# EAGLE design MAX-6566-Adapter v2.1 (EAGLE 7.7.0)
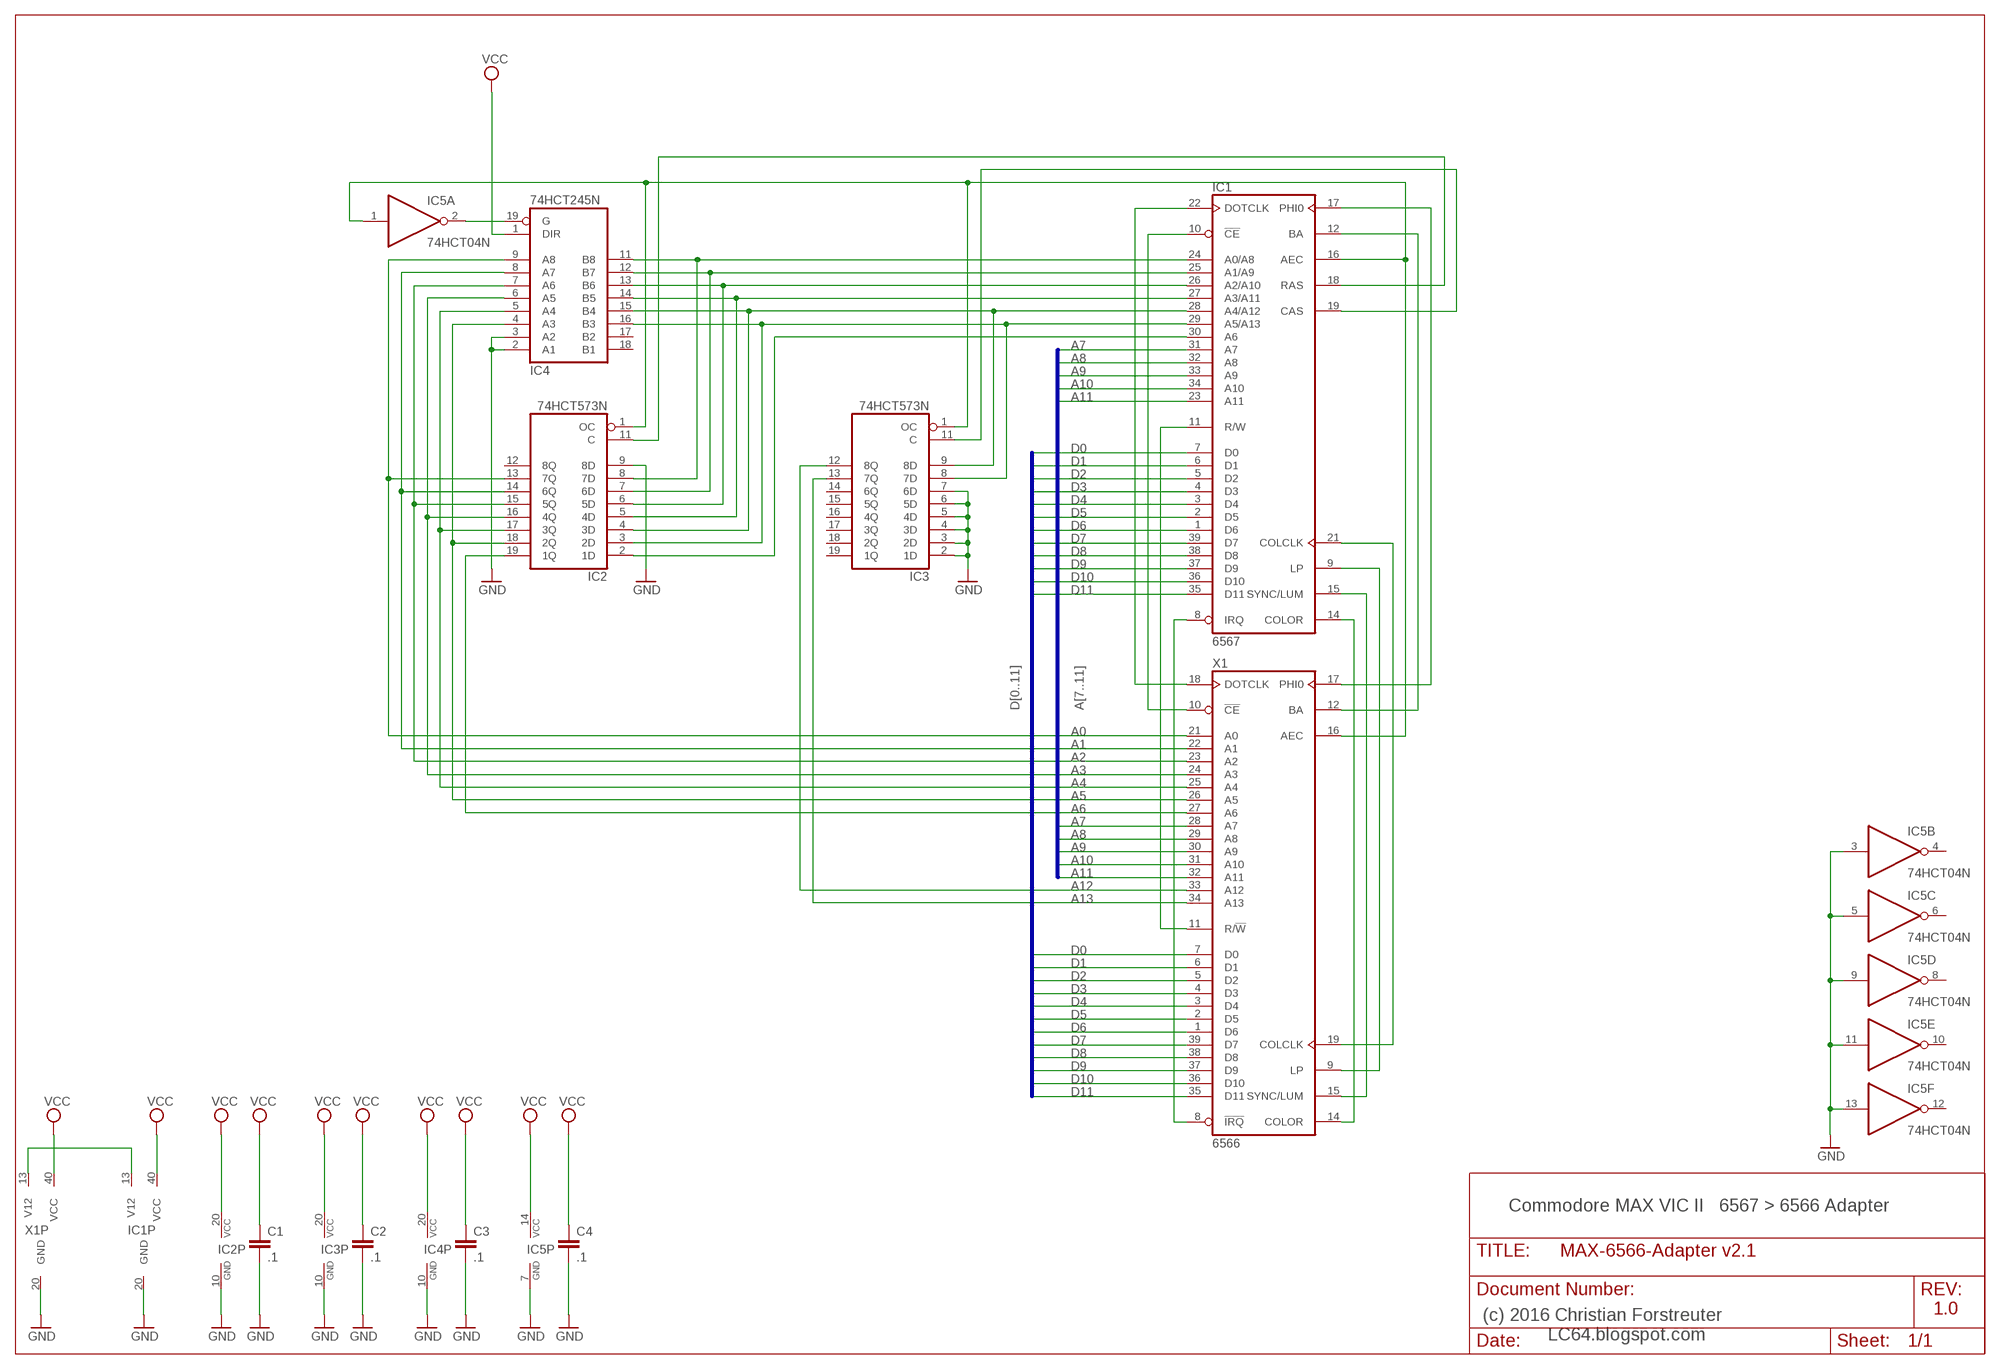
[diagram p0: schematic, sheet 1]

## Parts
C1  .1  C-EU025-024X044  [C025-024X044]
C2  .1  C-EU025-024X044  [C025-024X044]
C3  .1  C-EU025-024X044  [C025-024X044]
C4  .1  C-EU025-024X044  [C025-024X044]
IC1  6567  6569-RP  [DIL40-ROUNDPAD]
IC2  74HCT573N  74XX-EU_74HCT573N  [74XX-EU_DIL20]
IC3  74HCT573N  74XX-EU_74HCT573N  [74XX-EU_DIL20]
IC4  74HCT245N  74XX-EU_74HCT245N  [74XX-EU_DIL20]
IC5  74HCT04N  74XX-EU_74HCT04N  [74XX-EU_DIL14]
X1  6566  6566-RP  [DIL40-ROUNDPAD]

## Nets
A0: IC2.13(7Q) IC4.9(A8) X1.21(A0)
A1: IC2.14(6Q) IC4.8(A7) X1.22(A1)
A2: IC2.15(5Q) IC4.7(A6) X1.23(A2)
A3: IC2.16(4Q) IC4.6(A5) X1.24(A3)
A4: IC2.17(3Q) IC4.5(A4) X1.25(A4)
A5: IC2.18(2Q) IC4.4(A3) X1.26(A5)
A6: IC2.19(1Q) X1.27(A6)
A7: IC1.31(A7) X1.28(A7)
A8: IC1.32(A8) X1.29(A8)
A9: IC1.33(A9) X1.30(A9)
A10: IC1.34(A10) X1.31(A10)
A11: IC1.23(A11) X1.32(A11)
A12: IC3.12(8Q) X1.33(A12)
A13: IC3.13(7Q) X1.34(A13)
AEC: IC1.16(AEC) IC2.1(OC) IC3.1(OC) IC5.1(A:I) X1.16(AEC)
D0: IC1.7(D0) X1.7(D0)
D1: IC1.6(D1) X1.6(D1)
D2: IC1.5(D2) X1.5(D2)
D3: IC1.4(D3) X1.4(D3)
D4: IC1.3(D4) X1.3(D4)
D5: IC1.2(D5) X1.2(D5)
D6: IC1.1(D6) X1.1(D6)
D7: IC1.39(D7) X1.39(D7)
D8: IC1.38(D8) X1.38(D8)
D9: IC1.37(D9) X1.37(D9)
D10: IC1.36(D10) X1.36(D10)
D11: IC1.35(D11) X1.35(D11)
GND: C1.2 C2.2 C3.2 C4.2 IC1.20(GND) IC2.9(8D) IC2.10(GND) IC3.2(1D) IC3.3(2D) IC3.4(3D) IC3.5(4D) IC3.6(5D) IC3.7(6D) IC3.10(GND) IC4.2(A1) IC4.3(A2) IC4.10(GND) IC5.3(B:I) IC5.5(C:I) IC5.7(P:GND) IC5.9(D:I) IC5.11(E:I) IC5.13(F:I) X1.20(GND)
N$1: IC1.9(LP) X1.9(LP)
N$3: IC1.12(BA) X1.12(BA)
N$4: IC1.17(PHI0) X1.17(PHI0)
N$5: IC1.15(SYNC/LUM) X1.15(SYNC/LUM)
N$6: IC1.14(COLOR) X1.14(COLOR)
N$7: IC1.22(DOTCLK) X1.18(DOTCLK)
N$8: IC1.21(COLCLK) X1.19(COLCLK)
N$9: IC1.11(R/W) X1.11(R/!W)
N$10: IC1.8(IRQ) X1.8(!IRQ)
N$11: IC1.10(!CE) X1.10(!CE)
N$21: IC4.19(G) IC5.2(A:O)
N$22: IC1.24(A0/A8) IC2.8(7D) IC4.11(B8)
N$23: IC1.18(RAS) IC2.11(C)
N$24: IC1.19(CAS) IC3.11(C)
N$25: IC1.13(V12) X1.13(V12)
N$26: IC1.26(A2/A10) IC2.6(5D) IC4.13(B6)
N$27: IC1.27(A3/A11) IC2.5(4D) IC4.14(B5)
N$28: IC1.28(A4/A12) IC2.4(3D) IC3.9(8D) IC4.15(B4)
N$29: IC1.29(A5/A13) IC2.3(2D) IC3.8(7D) IC4.16(B3)
N$30: IC1.30(A6) IC2.2(1D)
N$35: IC1.25(A1/A9) IC2.7(6D) IC4.12(B7)
VCC: C1.1 C2.1 C3.1 C4.1 IC1.40(VCC) IC2.20(VCC) IC3.20(VCC) IC4.1(DIR) IC4.20(VCC) IC5.14(P:VCC) X1.40(VCC)
Unconnected: IC2.12(8Q) IC3.14(6Q) IC3.15(5Q) IC3.16(4Q) IC3.17(3Q) IC3.18(2Q) IC3.19(1Q) IC4.17(B2) IC4.18(B1) IC5.4(B:O) IC5.6(C:O) IC5.8(D:O) IC5.10(E:O) IC5.12(F:O)

## Buses
D[0..11]
A[7..11]

## Notes on the sheet
- Commodore MAX VIC II   6567 > 6566 Adapter
- 1.0
- (c) 2016 Christian Forstreuter
               LC64.blogspot.com

## Library data of the parts
C1-C4 = rcl:C-EU: CAPACITOR, European symbol
IC1 = commodore:6569: Video IC, PAL-version, used in the Commodore 64 and VIC-10. 6567 NTSC version is pin compatible.
IC2 IC3 = MAX-6566-Adapter:74XX-EU_74*573: 8-bit D latch BUS DRIVER
IC4 = MAX-6566-Adapter:74XX-EU_74*245: Octal BUS TRANSCEIVER, 3-state
IC5 = MAX-6566-Adapter:74XX-EU_74*04: Hex INVERTER
X1 = commodore:6566: Video IC, PAL-version, used in the Commodore 64 and VIC-10. 6567 NTSC version is pin compatible.

## Board
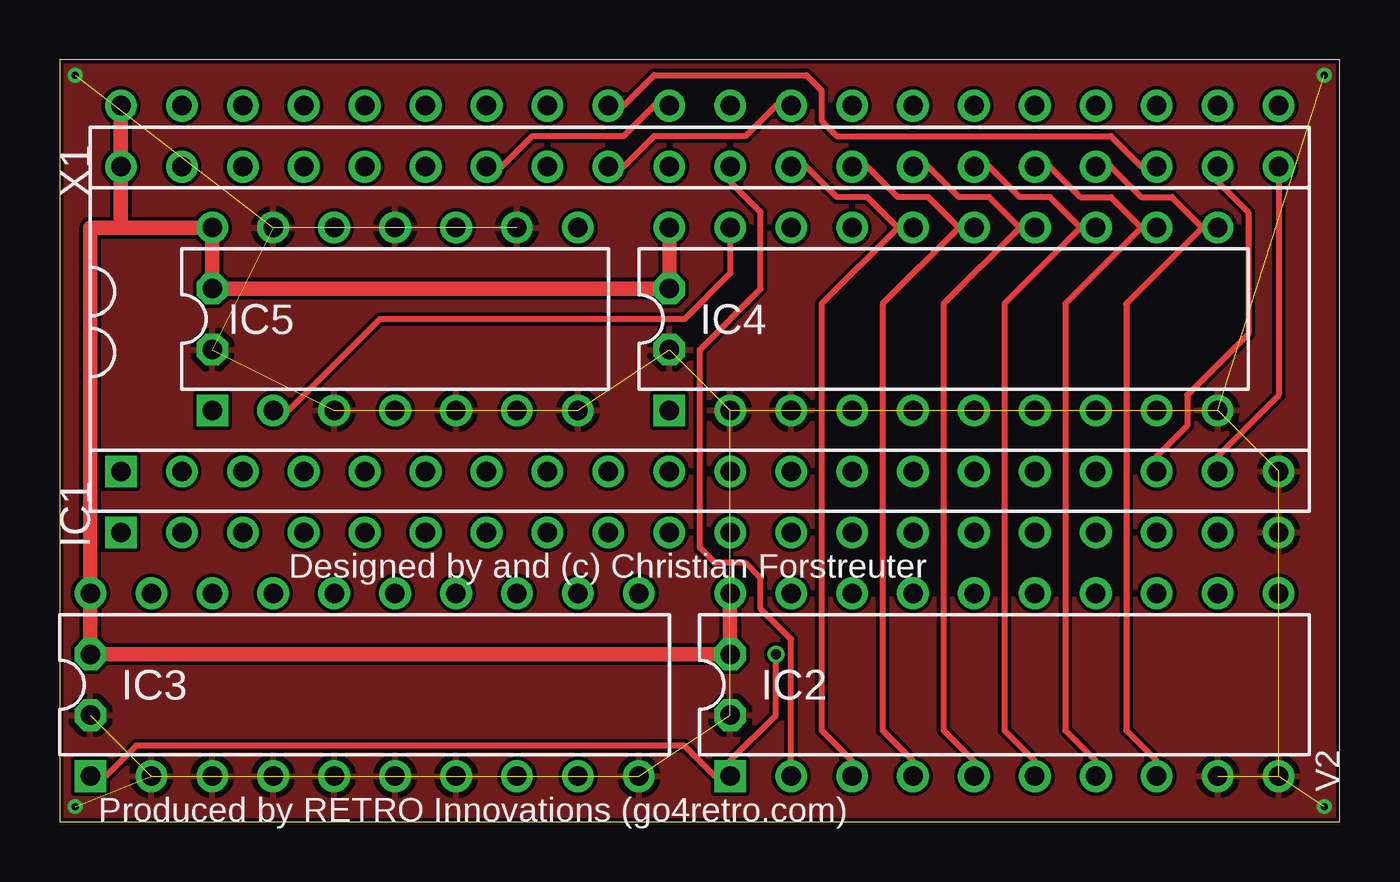
[diagram p1: board, top side]
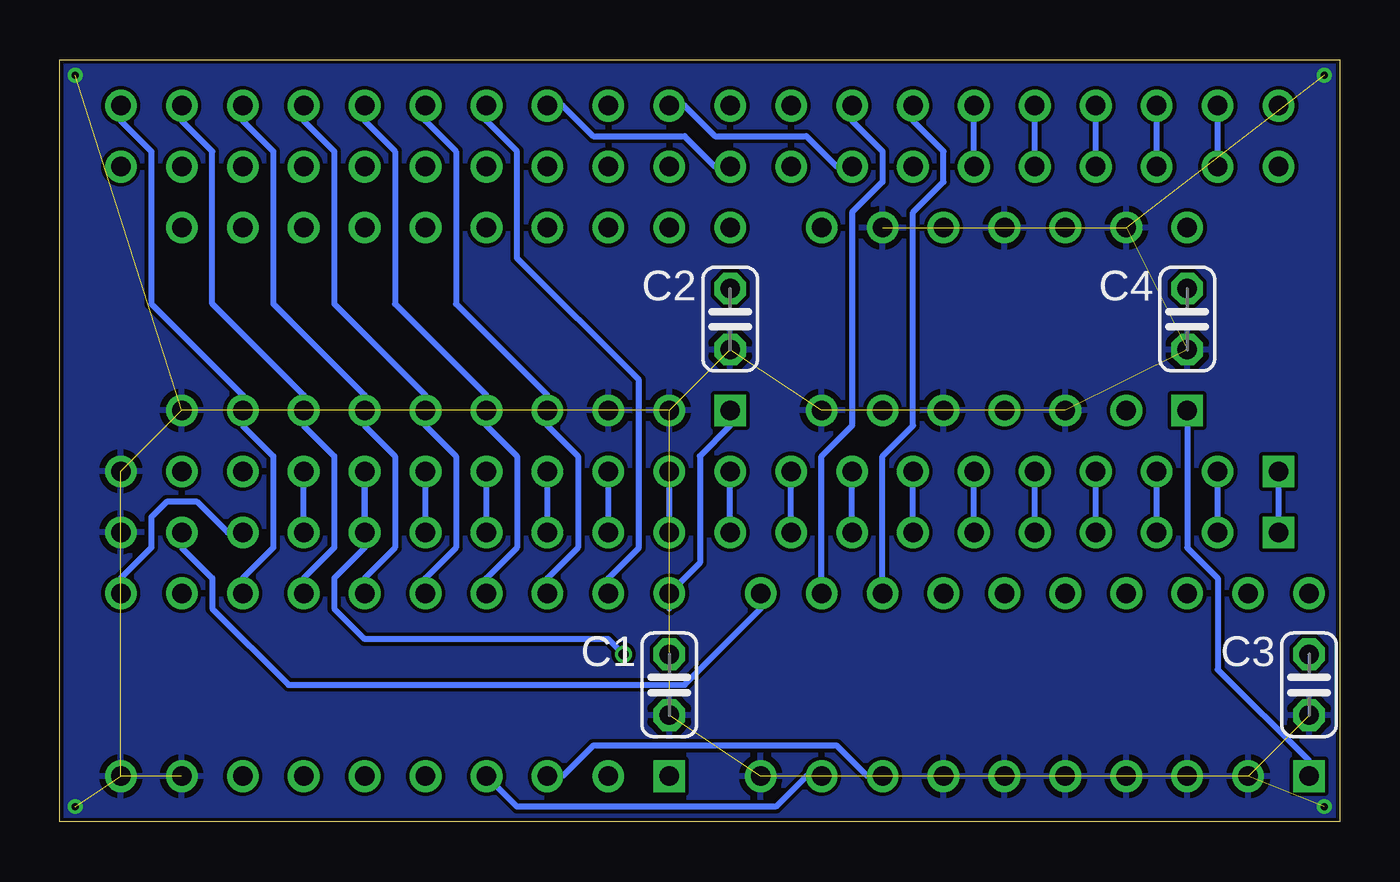
[diagram p2: board, bottom side, seen from below]

Size 53.34 x 31.75 mm. Coordinates in mm from the lower left corner, seen from the top.
Outline: 0,0 53.34,0 53.34,31.75 0,31.75 0,0
Copper layers (1*16): Top 0.035mm / dielectric 1.5mm / Bottom 0.035mm
Design rules "hackvana": minimum track width 6mil, minimum drill 0.3mm, track to track 6mil, track to pad 6mil, pad to pad 6mil, via to via 6mil, smd to smd 0mil, copper to edge 6mil, drill to drill 6mil, minimum pad ring 10mil, minimum via ring 6mil, stop-mask expansion 2mil, vias tented up to drill 100mil, thermal gap 10mil

### Footprints (pad centres in the part's own frame; a part is rotated, then mirrored left to right if it is on the bottom)
C025-024X044 = drill 0.813 octagon: 1 -1.27,0; 2 1.27,0
DIL40-ROUNDPAD = drill 0.813 square: 1 -24.13,-7.62 | drill 0.813: 2 -21.59,-7.62; 3 -19.05,-7.62; 4 -16.51,-7.62; 5 -13.97,-7.62; 6 -11.43,-7.62; 7 -8.89,-7.62; 8 -6.35,-7.62; 9 -3.81,-7.62; 10 -1.27,-7.62; 11 1.27,-7.62; 12 3.81,-7.62; 13 6.35,-7.62; 14 8.89,-7.62; 15 11.43,-7.62; 16 13.97,-7.62; 17 16.51,-7.62; 18 19.05,-7.62; 19 21.59,-7.62; 20 24.13,-7.62; 21 24.13,7.62; 22 21.59,7.62; 23 19.05,7.62; 24 16.51,7.62; 25 13.97,7.62; 26 11.43,7.62; 27 8.89,7.62; 28 6.35,7.62; 29 3.81,7.62; 30 1.27,7.62; 31 -1.27,7.62; 32 -3.81,7.62; 33 -6.35,7.62; 34 -8.89,7.62; 35 -11.43,7.62; 36 -13.97,7.62; 37 -16.51,7.62; 38 -19.05,7.62; 39 -21.59,7.62; 40 -24.13,7.62
74XX-EU_DIL20 = drill 0.813 square: 1 -11.43,-3.81 | drill 0.813: 2 -8.89,-3.81; 3 -6.35,-3.81; 4 -3.81,-3.81; 5 -1.27,-3.81; 6 1.27,-3.81; 7 3.81,-3.81; 8 6.35,-3.81; 9 8.89,-3.81; 10 11.43,-3.81; 11 11.43,3.81; 12 8.89,3.81; 13 6.35,3.81; 14 3.81,3.81; 15 1.27,3.81; 16 -1.27,3.81; 17 -3.81,3.81; 18 -6.35,3.81; 19 -8.89,3.81; 20 -11.43,3.81
74XX-EU_DIL14 = drill 0.813 square: 1 -7.62,-3.81 | drill 0.813: 2 -5.08,-3.81; 3 -2.54,-3.81; 4 0,-3.81; 5 2.54,-3.81; 6 5.08,-3.81; 7 7.62,-3.81; 8 7.62,3.81; 9 5.08,3.81; 10 2.54,3.81; 11 0,3.81; 12 -2.54,3.81; 13 -5.08,3.81; 14 -7.62,3.81

### Placement (x,y rotation side)
C1  27.94,5.71 270 bottom
C2  25.4,20.95 270 bottom
C3  1.27,5.71 270 bottom
C4  6.35,20.95 270 bottom
IC1  26.67,19.68 0 top
IC2  39.37,5.71 0 top
IC3  12.7,5.71 0 top
IC4  36.83,20.95 0 top
IC5  13.97,20.95 0 top
X1  26.67,22.22 0 top

### Tracks (layer width: path | path; a pad name or v marks a point on that pad's centre or on a via)
A0
  Bottom 0.254: X1.21 50.8,29.21 49.53,27.94 49.53,21.59 45.72,17.78 IC4.9 45.72,16.51 44.45,15.24 44.45,11.43 45.72,10.16 IC2.13
A1
  Bottom 0.254: X1.22 48.26,29.21 46.99,27.94 46.99,21.59 43.18,17.78 IC4.8 43.18,16.51 41.91,15.24 41.91,11.43 43.18,10.16 IC2.14
A2
  Bottom 0.254: X1.23 45.72,29.21 44.45,27.94 44.45,21.59 40.64,17.78 IC4.7 40.64,16.51 39.37,15.24 39.37,11.43 40.64,10.16 IC2.15
A3
  Bottom 0.254: X1.24 43.18,29.21 41.91,27.94 41.91,21.59 38.1,17.78 IC4.6 38.1,16.51 36.83,15.24 36.83,11.43 38.1,10.16 IC2.16
A4
  Bottom 0.254: X1.25 40.64,29.21 39.37,27.94 39.37,21.59 35.56,17.78 IC4.5 35.56,16.51 34.29,15.24 34.29,11.43 35.56,10.16 IC2.17
A5
  Bottom 0.254: X1.26 38.1,29.21 36.83,27.94 36.83,21.59 33.02,17.78 IC4.4 33.02,16.51 31.75,15.24 31.75,11.43 33.02,10.16 IC2.18
A6
  Bottom 0.254: IC2.19 30.48,10.16 29.21,11.43 29.21,18.41 34.29,23.49 34.29,27.94 35.56,29.21 X1.27
A7
  Bottom 0.254: X1.28 32.38,29.84 31.11,28.57 27.3,28.57 26.04,27.3 IC1.31
A8
  Top 0.254: X1.29 29.84,29.84 28.57,28.57 24.77,28.57 23.5,27.3 IC1.32
A9
  Bottom 0.254: X1.30 27.3,29.84 26.04,28.57 22.23,28.57 20.95,27.3 IC1.33
A10
  Top 0.254: X1.31 24.77,29.84 23.5,28.57 19.68,28.57 18.41,27.3 IC1.34
A11
  Top 0.254: X1.32 23.5,29.84 24.77,31.11 31.11,31.11 31.75,30.48 31.75,29.21 32.38,28.57 43.81,28.57 45.09,27.3 IC1.23
A12
  Bottom 0.254: X1.33 20.32,29.21 19.05,27.94 19.05,26.67 20.32,25.4 20.32,16.51 21.59,15.24 IC3.12
A13
  Bottom 0.254: IC3.13 19.05,15.24 17.78,16.51 17.78,25.4 16.51,26.67 16.51,27.94 17.78,29.21 X1.34
AEC  (via drill 0.41)
  Top 0.254: v29.84,6.99 29.84,4.45 27.94,2.54 IC2.1 27.3,1.91 26.04,3.17 3.17,3.17 1.91,1.91 IC3.1
  Bottom 0.254: IC1.16 X1.16 40.64,11.43 41.91,10.16 41.91,8.89 40.64,7.62 30.48,7.62 v29.84,6.99 | IC5.1 6.35,11.43 5.08,10.16 5.08,6.35 1.27,2.54 IC3.1
D0
  Bottom 0.254: IC1.7 X1.7
D1
  Bottom 0.254: IC1.6 X1.6
D2
  Bottom 0.254: IC1.5 X1.5
D3
  Bottom 0.254: IC1.4 X1.4
D4
  Bottom 0.254: IC1.3 X1.3
D5
  Bottom 0.254: IC1.2 X1.2
D6
  Bottom 0.254: IC1.1 X1.1
D7
  Bottom 0.254: IC1.39 X1.39
D8
  Bottom 0.254: IC1.38 X1.38
D9
  Bottom 0.254: IC1.37 X1.37
D10
  Bottom 0.254: IC1.36 X1.36
D11
  Bottom 0.254: IC1.35 X1.35
GND  (via drill 0.3)  (27 unrouted)
  other vias: 0.64,31.11 0.64,0.64 52.7,0.64 52.7,31.11
  pour Bottom: 0,31.75 53.34,31.75 53.34,0 0,0
  pour Top: 0,31.75 53.34,31.75 53.34,0 0,0
N$1
  Bottom 0.254: IC1.9 X1.9
N$3
  Bottom 0.254: IC1.12 X1.12
N$4
  Bottom 0.254: IC1.17 X1.17
N$5
  Bottom 0.254: IC1.15 X1.15
N$6
  Bottom 0.254: IC1.14 X1.14
N$7
  Top 0.254: IC1.22 48.26,26.67 49.53,25.4 49.53,20.32 46.99,17.78 46.99,16.51 45.72,15.24 X1.18
N$8
  Top 0.254: IC1.21 50.8,17.78 48.26,15.24 X1.19
N$9
  Bottom 0.254: IC1.11 X1.11
N$10
  Bottom 0.254: IC1.8 X1.8
N$11
  Bottom 0.254: IC1.10 X1.10
N$21
  Top 0.254: IC4.19 27.94,22.86 26.04,20.95 13.34,20.95 9.53,17.14 IC5.2
N$22
  Top 0.254: IC1.24 43.81,27.3 45.09,26.04 46.35,26.04 47.62,24.76 | 47.62,24.76 IC4.11 | 47.62,24.76 44.45,21.59 44.45,3.81 45.72,2.54 IC2.8
N$23
  Bottom 0.254: IC1.18 46.35,12.06 47.62,13.34 48.9,13.34 49.53,12.7 49.53,11.43 50.8,10.16 IC2.11
N$24
  Bottom 0.254: IC1.19 48.26,11.43 46.99,10.16 46.99,8.89 43.81,5.71 27.3,5.71 24.13,8.89 IC3.11
N$25
  Bottom 0.254: IC1.13 X1.13
N$26
  Top 0.254: IC4.13 42.55,24.76 | 42.55,24.76 41.27,26.04 40.01,26.04 38.73,27.3 IC1.26 | 42.55,24.76 39.37,21.59 39.37,3.81 40.64,2.54 IC2.6
N$27
  Top 0.254: IC4.14 40.01,24.76 | 40.01,24.76 38.73,26.04 37.47,26.04 36.2,27.3 IC1.27 | 40.01,24.76 36.83,21.59 36.83,3.81 38.1,2.54 IC2.5
N$28
  Top 0.254: IC4.15 37.47,24.76 | 37.47,24.76 36.2,26.04 34.92,26.04 33.66,27.3 IC1.28 | 37.47,24.76 34.29,21.59 34.29,3.81 35.56,2.54 IC2.4
  Bottom 0.254: IC2.4 34.29,0.64 23.5,0.64 22.23,1.91 IC3.9
N$29
  Top 0.254: IC4.16 34.92,24.76 | 34.92,24.76 33.66,26.04 32.38,26.04 31.11,27.3 IC1.29 | 34.92,24.76 31.75,21.59 31.75,3.81 33.02,2.54 IC2.3
  Bottom 0.254: IC2.3 32.38,1.91 31.11,3.17 20.95,3.17 19.68,1.91 IC3.8
N$30
  Top 0.254: IC2.2 30.48,7.62 29.21,8.89 29.21,10.16 28.57,10.79 27.3,10.79 26.67,11.43 26.67,19.68 29.21,22.22 29.21,25.4 27.94,26.67 IC1.30
N$35
  Top 0.254: IC1.25 41.27,27.3 42.55,26.04 43.81,26.04 45.09,24.76 | 45.09,24.76 IC4.12 | 45.09,24.76 41.91,21.59 41.91,3.81 43.18,2.54 IC2.7
VCC
  Top 0.61: 2.54,24.76 X1.40 IC1.40 | 2.54,24.76 IC5.14 C4.1 C2.1 IC4.20 | IC2.20 C1.1 C3.1 IC3.20 1.27,24.76 2.54,24.76
  Bottom 0.254: IC4.1 25.4,16.51 26.67,15.24 26.67,10.79 IC2.20 27.94,8.89

### Text on the board
tNames: Designed by and (c) Christian Forstreuter | V2 | Produced by RETRO Innovations (go4retro.com)